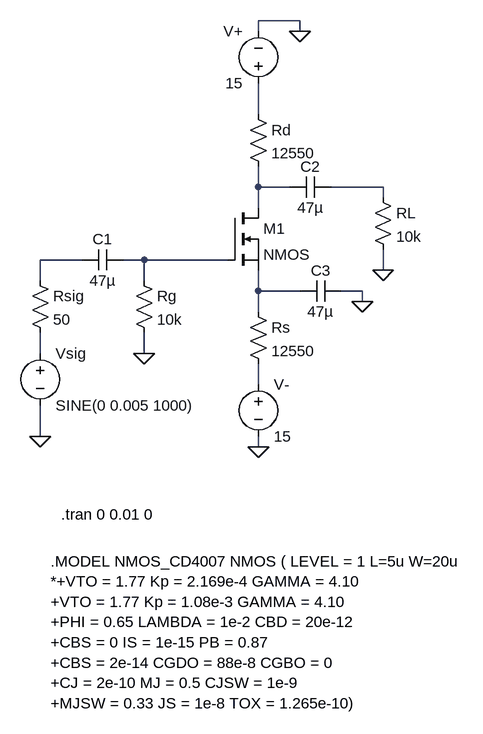
[diagram p0: schematic F1a.asc]
F1a.asc, the LTspice schematic file:
Version 4.1
SHEET 1 880 772
WIRE 320 -272 256 -272
WIRE 256 -256 256 -272
WIRE 320 -256 320 -272
WIRE 256 -128 256 -176
WIRE 256 -16 256 -48
WIRE 304 -16 256 -16
WIRE 448 -16 368 -16
WIRE 448 0 448 -16
WIRE 256 16 256 -16
WIRE -16 96 -80 96
WIRE 80 96 48 96
WIRE 208 96 80 96
WIRE 448 112 448 80
WIRE -80 128 -80 96
WIRE 80 128 80 96
WIRE 256 144 256 112
WIRE 320 144 256 144
WIRE 416 144 384 144
WIRE 416 160 416 144
WIRE 256 176 256 144
WIRE -80 240 -80 208
WIRE 80 240 80 208
WIRE 256 288 256 256
WIRE -80 368 -80 320
WIRE 256 384 256 368
FLAG -80 368 0
FLAG 80 240 0
FLAG 416 160 0
FLAG 448 112 0
FLAG 320 -256 0
FLAG 256 384 0
SYMBOL voltage -80 224 R0
WINDOW 123 0 0 Left 0
WINDOW 39 0 0 Left 0
SYMATTR InstName Vsig
SYMATTR Value SINE(0 0.005 1000)
SYMBOL res -96 112 R0
SYMATTR InstName Rsig
SYMATTR Value 50
SYMBOL cap 48 80 R90
WINDOW 0 0 32 VBottom 2
WINDOW 3 32 32 VTop 2
SYMATTR InstName C1
SYMATTR Value 47µ
SYMBOL res 64 112 R0
SYMATTR InstName Rg
SYMATTR Value 10k
SYMBOL nmos 208 16 R0
SYMATTR InstName M1
SYMBOL res 240 160 R0
SYMATTR InstName Rs
SYMATTR Value 12550
SYMBOL res 240 -144 R0
SYMATTR InstName Rd
SYMATTR Value 12550
SYMBOL res 432 -16 R0
SYMATTR InstName RL
SYMATTR Value 10k
SYMBOL cap 368 -32 R90
WINDOW 0 0 32 VBottom 2
WINDOW 3 32 32 VTop 2
SYMATTR InstName C2
SYMATTR Value 47µ
SYMBOL cap 384 128 R90
WINDOW 0 0 32 VBottom 2
WINDOW 3 32 32 VTop 2
SYMATTR InstName C3
SYMATTR Value 47µ
SYMBOL voltage 256 -160 R180
WINDOW 0 24 96 Left 2
WINDOW 3 24 16 Left 2
SYMATTR InstName V+
SYMATTR Value 15
SYMBOL voltage 256 272 R0
SYMATTR InstName V-
SYMATTR Value 15
TEXT -48 488 Left 2 !.tran 0 0.01 0
TEXT -64 560 Left 2 !.MODEL NMOS_CD4007 NMOS ( LEVEL = 1 L=5u W=20u\n*+VTO = 1.77 Kp = 2.169e-4 GAMMA = 4.10\n+VTO = 1.77 Kp = 1.08e-3 GAMMA = 4.10\n+PHI = 0.65 LAMBDA = 1e-2 CBD = 20e-12\n+CBS = 0 IS = 1e-15 PB = 0.87\n+CBS = 2e-14 CGDO = 88e-8 CGBO = 0\n+CJ = 2e-10 MJ = 0.5 CJSW = 1e-9\n+MJSW = 0.33 JS = 1e-8 TOX = 1.265e-10)

The netlist it stands for:
* F1a.asc
Vsig N007 0 SINE(0 0.005 1000)
Rsig N004 N007 50
C1 N005 N004 47µ
Rg N005 0 10k
M1 N002 N005 N006 N006 NMOS
Rs N006 N008 12550
Rd N001 N002 12550
RL N003 0 10k
C2 N003 N002 47µ
C3 0 N006 47µ
V+ N001 0 15
V- N008 0 15
.model NMOS NMOS
.model PMOS PMOS
.lib standard.mos
.tran 0 0.01 0
.MODEL NMOS_CD4007 NMOS ( LEVEL = 1 L=5u W=20u
*+VTO = 1.77 Kp = 2.169e-4 GAMMA = 4.10
+VTO = 1.77 Kp = 1.08e-3 GAMMA = 4.10
+PHI = 0.65 LAMBDA = 1e-2 CBD = 20e-12
+CBS = 0 IS = 1e-15 PB = 0.87
+CBS = 2e-14 CGDO = 88e-8 CGBO = 0
+CJ = 2e-10 MJ = 0.5 CJSW = 1e-9
+MJSW = 0.33 JS = 1e-8 TOX = 1.265e-10)
.backanno
.end